# EAGLE design Tinyusbboard rev3 THT (EAGLE 6.5.0)
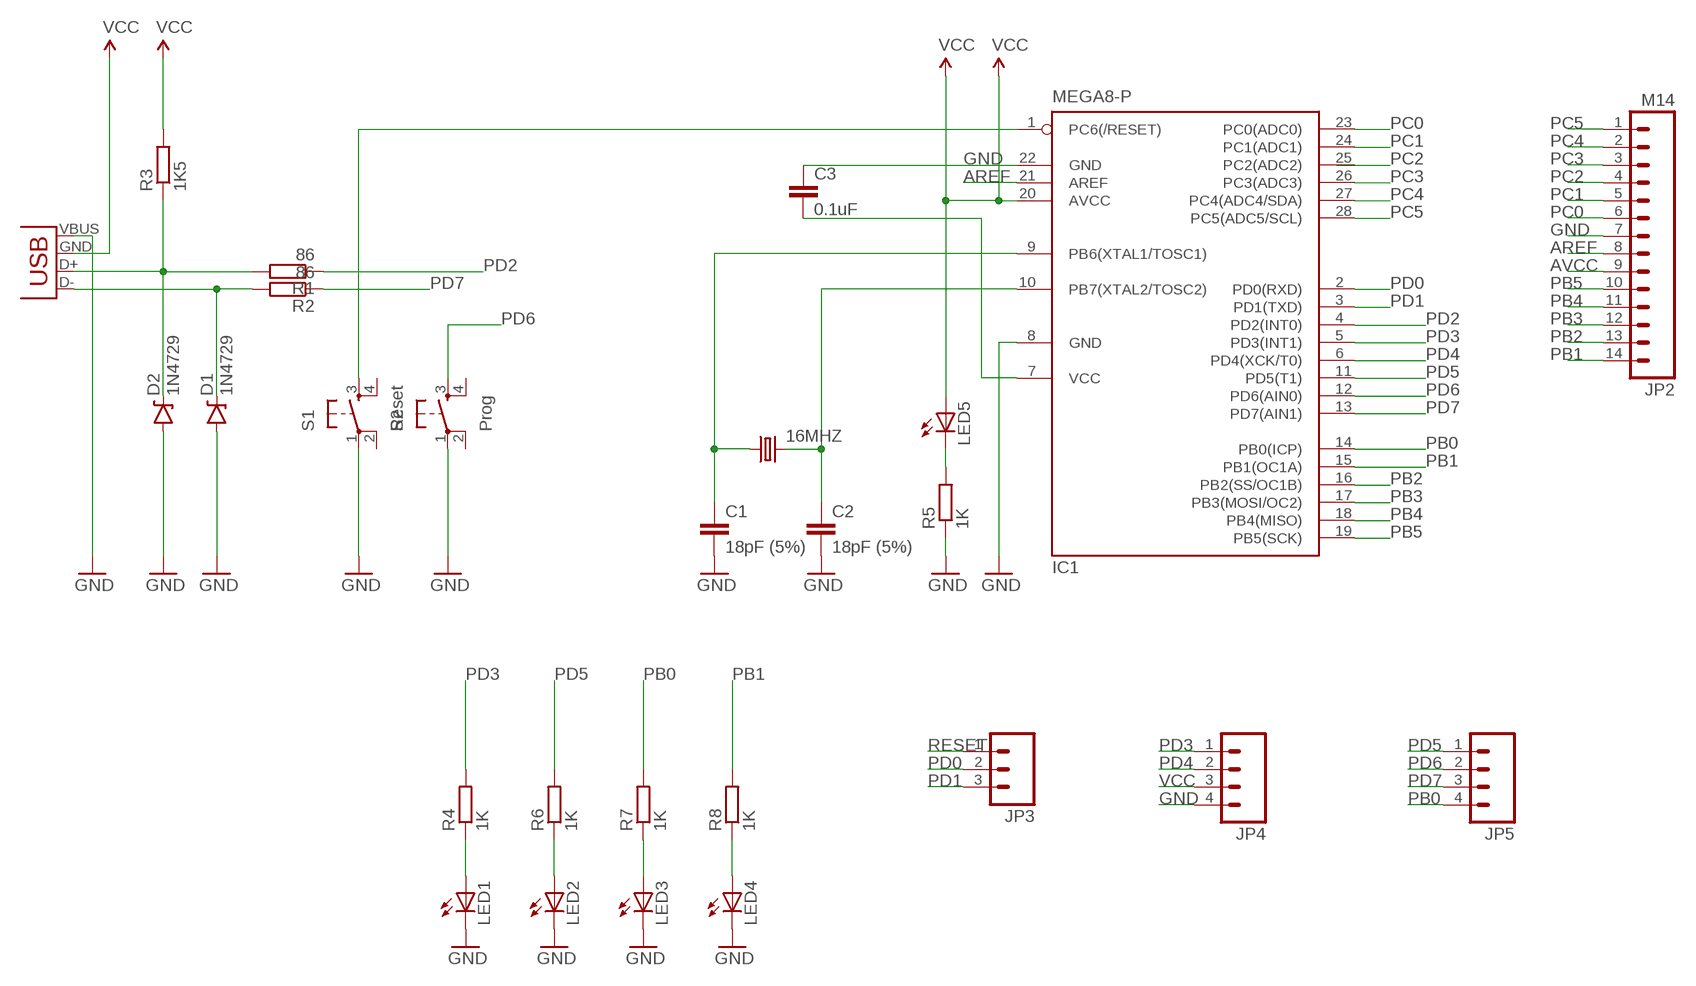
[diagram p0: schematic, sheet 1]

## Parts
16MHZ  CRYSTALTC26V  [TC26V]
C1  18pF (5%)  C-EU025-024X044  [C025-024X044]
C2  18pF (5%)  C-EU025-024X044  [C025-024X044]
C3  0.1uF  C-EU025-024X044  [C025-024X044]
D1  1N4729  DIODE-ZENERPTH  [DIODE-ZENER]
D2  1N4729  DIODE-ZENERPTH  [DIODE-ZENER]
IC1  MEGA8-P  [DIL28-3]
JP1  USB-A-H  [USB-A-H]
JP2  M14  [1X14]
JP3  M03PTH  [1X03]
JP4  M04PTH  [1X04]
JP5  M04PTH  [1X04]
LED1  LED3MM  [LED3MM]
LED2  LED3MM  [LED3MM]
LED3  LED3MM  [LED3MM]
LED4  LED3MM  [LED3MM]
LED5  LED3MM  [LED3MM]
R1  86  R-EU_0204/7  [0204/7]
R2  86  R-EU_0204/7  [0204/7]
R3  1K5  R-EU_0204/7  [0204/7]
R4  1K  R-EU_0204/7  [0204/7]
R5  1K  R-EU_0204/7  [0204/7]
R6  1K  R-EU_0204/2V  [0204V]
R7  1K  R-EU_0204/2V  [0204V]
R8  1K  R-EU_0204/7  [0204/7]
S1  Reset  TAC_SWITCHPTH  [TACTILE-PTH]
S2  Prog  TAC_SWITCHPTH  [TACTILE-PTH]

## Nets
AREF: IC1.21(AREF) JP2.8
AVCC: JP2.9
D+: D1.P$1(C) JP1.D-(D+) R2.2
D-: D2.P$1(C) JP1.D+(D-) R1.2 R3.1
GND: C1.2 C2.2 C3.1 D1.P$2(A) D2.P$2(A) IC1.8(GND) IC1.22(GND) JP1.VBUS(GND) JP2.7 JP4.4 LED1.K(C) LED2.K(C) LED3.K(C) LED4.K(C) R5.1 S1.1 S2.1
N$1: C3.2 IC1.7(VCC)
N$2: LED5.K(C) R5.2
N$6: LED1.A R4.1
N$7: LED2.A R6.1
N$8: LED3.A R7.1
N$12: LED4.A R8.1
N$15: 16MHZ.1 C1.1 IC1.9(PB6(XTAL1/TOSC1))
N$16: 16MHZ.2 C2.1 IC1.10(PB7(XTAL2/TOSC2))
PB0: IC1.14(PB0(ICP)) JP5.4 R7.2
PB1: IC1.15(PB1(OC1A)) JP2.14 R8.2
PB2: IC1.16(PB2(SS/OC1B)) JP2.13
PB3: IC1.17(PB3(MOSI/OC2)) JP2.12
PB4: IC1.18(PB4(MISO)) JP2.11
PB5: IC1.19(PB5(SCK)) JP2.10
PC0: IC1.23(PC0(ADC0)) JP2.6
PC1: IC1.24(PC1(ADC1)) JP2.5
PC2: IC1.25(PC2(ADC2)) JP2.4
PC3: IC1.26(PC3(ADC3)) JP2.3
PC4: IC1.27(PC4(ADC4/SDA)) JP2.2
PC5: IC1.28(PC5(ADC5/SCL)) JP2.1
PD0: IC1.2(PD0(RXD)) JP3.2
PD1: IC1.3(PD1(TXD)) JP3.3
PD2: IC1.4(PD2(INT0)) R1.1
PD3: IC1.5(PD3(INT1)) JP4.1 R4.2
PD4: IC1.6(PD4(XCK/T0)) JP4.2
PD5: IC1.11(PD5(T1)) JP5.1 R6.2
PD6: IC1.12(PD6(AIN0)) JP5.2 S2.3
PD7: IC1.13(PD7(AIN1)) JP5.3 R2.1
RESET: IC1.1(PC6(/RESET)) JP3.1 S1.3
VCC: IC1.20(AVCC) JP1.GND(VBUS) JP4.3 LED5.A R3.2
Unconnected: S1.2 S1.4 S2.2 S2.4

## Library data of the parts
16MHZ = adafruit:CRYSTAL: CRYSTAL; OC_FARNELL: unknown; OC_NEWARK: unknown
C1-C3 = rcl:C-EU: CAPACITOR, European symbol
D1 D2 = SparkFun-DiscreteSemi:DIODE-ZENER: Zener Diode Production Part - 8199 3.4V Zener Voltage
IC1 = atmel:MEGA8-P: MICROCONTROLLER 8 Kbytes FLASH, 1 kbytes SRAM, 512 bytes EEPROM, USART, 4-channel 10 bit ADC, 2-channel 8 bit ADC Pin compatible with Atmega48, ATMega88, ATMega168 Source: avr.lbr; OC_FARNELL: unknown; OC_NEWARK: unknown
JP1 = SparkFun-Connectors:USB: USB Connectors USB-B-PTH is fully proven SKU : PRT-00139/CONN-08278 USB-miniB is fully proven SKU : PRT-00587 USB-A-PCB is untested. USB-A-H is throughly reviewed, but untested. Spark Fun Electronics SKU : PRT-00437 USB-B-SMT is throughly reviewed, but untested. Needs silkscreen touching up. USB-A-S has not been used/tested USB-MB-H has not been used/tested USB-MICROB has been used. CONN-09505
JP2 = SparkFun-Connectors:M14: Header 14 Standard 14-pin 0.1" header. Use with straight break away headers (SKU : PRT-00116), right angle break away headers (PRT-00553), swiss pins (PRT-00743), machine pins (PRT-00117), and female headers (PRT-00115).
JP3 = SparkFun-Connectors:M03: Header 3 Standard 3-pin 0.1" header. Use with straight break away headers (SKU : PRT-00116), right angle break away headers (PRT-00553), swiss pins (PRT-00743), machine pins (PRT-00117), and female headers (PRT-00115). Molex polarized connector foot print use with SKU : PRT-08232 with associated crimp pins and housings.
JP4 JP5 = SparkFun-Connectors:M04: Header 4 Standard 4-pin 0.1" header. Use with straight break away headers (SKU : PRT-00116), right angle break away headers (PRT-00553), swiss pins (PRT-00743), machine pins (PRT-00117), and female headers (PRT-00115). Molex polarized connector foot print use with SKU : PRT-08231 with associated crimp pins and housings. 1MM SMD Version SKU: PRT-10208
LED1-LED5 = adafruit:LED: LED OSRAM: - CHIPLED LG R971, LG N971, LY N971, LG Q971, LY Q971, LO R971, LY R971 LH N974, LH R974 LS Q976, LO Q976, LY Q976 LO Q996 - Hyper CHIPLED LW Q18S LB Q993, LB Q99A, LB R99A - SideLED LS A670, LO A670, LY A670, LG A670, LP A670 LB A673, LV A673, LT A673, LW A673 LH A674 LY A675 LS A676, LA A676, LO A676, LY A676, LW A676 LS A679, LY A679, LG A679 - Hyper Micro SIDELED® LS Y876, LA Y876, LO Y876, LY Y876 LT Y87S - SmartLED LW L88C, LW L88S LB L89C, LB L89S, LG L890 LS L89K, LO L89K, LY L89K LS L896, LA L896, LO L896, LY L896 - TOPLED LS T670, LO T670, LY T670, LG T670, LP T670 LSG T670, LSP T670, LSY T670, LOP T670, LYG T670 LG T671, LOG T671, LSG T671 LB T673, LV T673, LT T673, LW T673 LH T674 LS T676, LA T676, LO T676, LY T676, LB T676, LH T676, LSB T676, LW T676 LB T67C, LV T67C, LT T67C, LS T67K, LO T67K, LY T67K, LW E67C LS E67B, LA E67B, LO E67B, LY E67B, LB E67C, LV E67C, LT E67C LW T67C LS T679, LY T679, LG T679 LS T770, LO T770, LY T770, LG T770, LP T770 LB T773, LV T773, LT T773, LW T773 LH T774 LS E675, LA E675, LY E675, LS T675 LS T776, LA T776, LO T776, LY T776, LB T776 LHGB T686 LT T68C, LB T68C - Hyper Mini TOPLED® LB M676 - Mini TOPLED Santana® LG M470 LS M47K, LO M47K, LY M47K Source: http://www.osram.convergy.de/
R1-R8 = rcl:R-EU_: RESISTOR, European symbol
S1 S2 = SparkFun-Retired:TAC_SWITCH: Momentary Switch Button commonly used for reset or general input. Spark Fun Electronics SKU : COM-00097 SMT- SWCH-08247

## Board
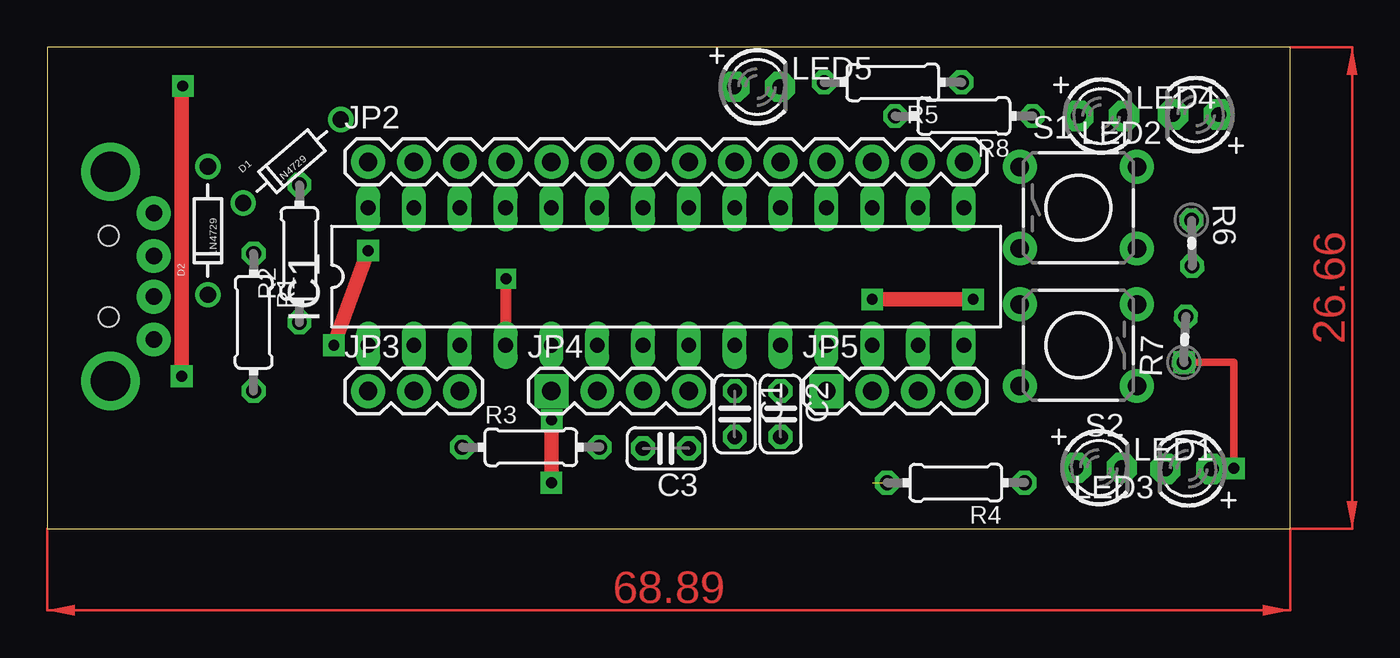
[diagram p1: board, top side]
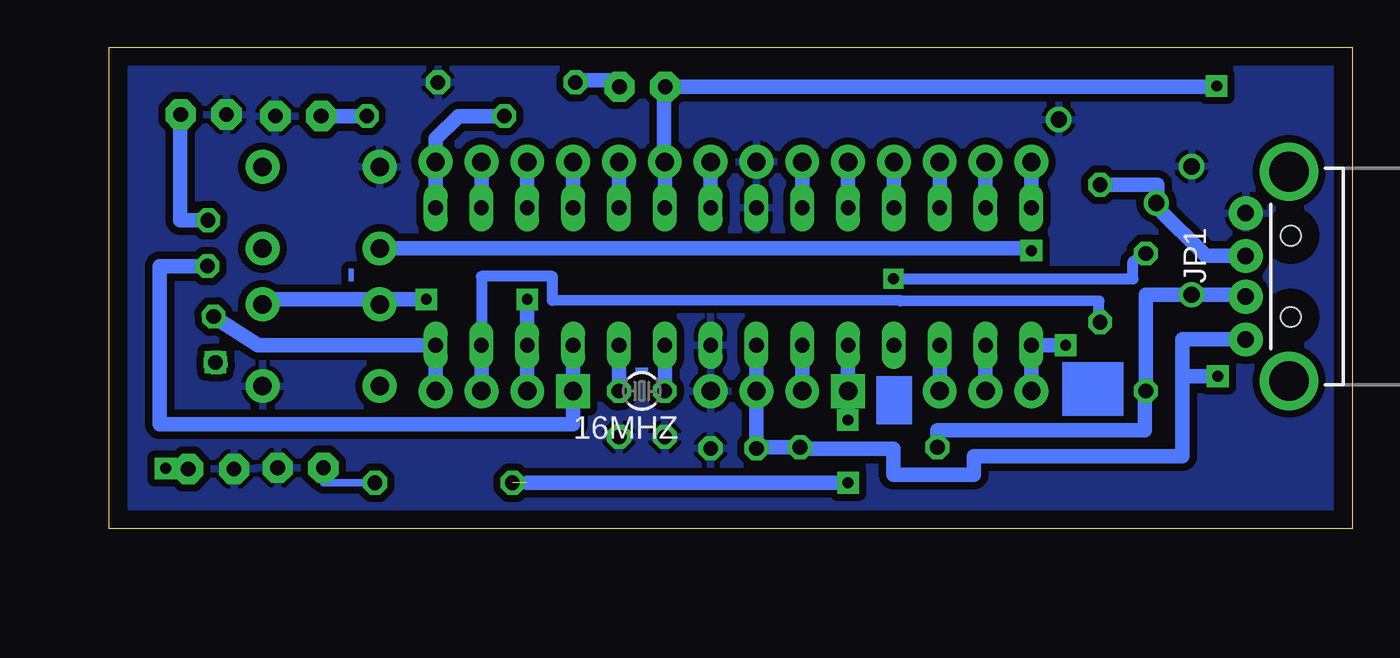
[diagram p2: board, bottom side, seen from below]

Size 68.89 x 26.66 mm. Coordinates in mm from the lower left corner, seen from the top.
Outline: 0,0 68.88,0 68.88,26.66 0,26.66 0,0
Copper layers (1*16): Top 0.035mm / dielectric 1.5mm / Bottom 0.035mm
Design rules "default *": minimum track width 10mil, minimum drill 24mil, track to track 12mil, track to pad 12mil, pad to pad 12mil, via to via 12mil, smd to smd 12mil, copper to edge 40mil, drill to drill 8mil, minimum pad ring 10mil, minimum via ring 8mil, stop-mask expansion 4mil, vias tented up to drill 0mil, thermal gap 10mil

### Footprints (pad centres in the part's own frame; a part is rotated, then mirrored left to right if it is on the bottom)
TC26V = drill 0.813: 1 -1.27,0; 2 1.27,0
C025-024X044 = drill 0.813 octagon: 1 -1.27,0; 2 1.27,0
DIODE-ZENER = drill 0.9: P$1 -3.556,0; P$2 3.556,0
DIL28-3 = drill 0.813 long: 1 -16.51,-3.81; 2 -13.97,-3.81; 3 -11.43,-3.81; 4 -8.89,-3.81; 5 -6.35,-3.81; 6 -3.81,-3.81; 7 -1.27,-3.81; 8 1.27,-3.81; 9 3.81,-3.81; 10 6.35,-3.81; 11 8.89,-3.81; 12 11.43,-3.81; 13 13.97,-3.81; 14 16.51,-3.81; 15 16.51,3.81; 16 13.97,3.81; 17 11.43,3.81; 18 8.89,3.81; 19 6.35,3.81; 20 3.81,3.81; 21 1.27,3.81; 22 -1.27,3.81; 23 -3.81,3.81; 24 -6.35,3.81; 25 -8.89,3.81; 26 -11.43,3.81; 27 -13.97,3.81; 28 -16.51,3.81
USB-A-H = drill 0.914 pad 1.88: D+ 2.4,1.127; D- 2.4,-1.127; GND 2.4,3.5; VBUS 2.4,-3.5 | drill 2.2: GND2 0,-5.8; GND3 0,5.8 | hole 1.1: -0.1,2.25; -0.1,-2.25
1X14 = drill 1.016 pad 1.88: 1 0,0; 2 2.54,0; 3 5.08,0; 4 7.62,0; 5 10.16,0; 6 12.7,0; 7 15.24,0; 8 17.78,0; 9 20.32,0; 10 22.86,0; 11 25.4,0; 12 27.94,0; 13 30.48,0; 14 33.02,0
1X03 = drill 1.016 pad 1.88: 1 0,0; 2 2.54,0; 3 5.08,0
1X04 = drill 1.016 pad 1.88 square: 1 0,0 | drill 1.016 pad 1.88: 2 2.54,0; 3 5.08,0; 4 7.62,0
LED3MM = drill 0.813 pad 1.676 octagon: A -1.27,0; K 1.27,0
0204/7 = drill 0.813 octagon: 1 -3.81,0; 2 3.81,0
0204V = drill 0.813 octagon: 1 -1.27,0; 2 1.27,0
TACTILE-PTH = drill 1.016 pad 1.88: 1 -3.251,2.261; 2 3.251,2.261; 3 -3.251,-2.261; 4 3.251,-2.261

### Placement (x,y rotation side)
16MHZ  39.37,7.62 180 bottom
C1  38.1,6.35 270 top
C2  40.64,6.35 270 top
C3  34.29,4.44 180 top
D1  13.55,20.35 40.5 top
D2  8.89,16.51 90 top
IC1  34.29,13.97 0 top
JP1  3.49,13.98 180 bottom
JP2  17.78,20.32 0 top
JP3  17.78,7.62 0 top
JP4  27.94,7.62 0 top
JP5  43.18,7.62 0 top
LED1  58.29,3.37 0 top
LED2  63.67,22.94 180 top
LED3  63.25,3.3 180 top
LED4  58.42,22.86 0 top
LED5  39.34,24.48 0 top
R1  11.43,11.43 270 top
R2  13.97,15.24 90 top
R3  26.8,4.51 0 top
R4  50.36,2.54 180 top
R5  46.86,24.72 180 top
R6  63.44,15.81 270.8 top
R7  63.06,10.48 87.6 top
R8  50.8,22.86 180 top
S1  57.15,17.78 0 top
S2  57.15,10.16 180 top

### Tracks (layer width: path | path; a pad name or v marks a point on that pad's centre or on a via)
AREF
  Bottom 0.813: JP2.8 IC1.21
D+
  Bottom 0.813: JP1.D- 8.12,15.1 10.79,17.78 | R2.2 10.79,19.05 10.79,17.78 | 10.79,17.78 10.85,17.78 D1.P$1
D-
  Bottom 0.406: R1.2 11.49,7.62
  Bottom 0.813: JP1.D+ 6,12.95 D2.P$1 11.43,12.95 R1.2 | 11.49,7.62 11.49,5.46 22.99,5.46 R3.1
GND
  pour Bottom (isolate 0.406): -0.57,28.89 73.41,28.89 73.41,-0.57 -0.57,-0.57
N$1
  Bottom 0.813: C3.2 33.01,7.65 33.02,7.65 IC1.7
N$2
  Bottom 0.406: LED5.K 40.63,24.48
  Bottom 0.813: 40.63,24.48 40.63,24.84 43.05,24.84 R5.2
N$6
  Bottom 0.406: R4.1 57.02,2.54 LED1.A
N$7
  Bottom 0.406: 63.5,17.08 R6.1 | LED2.A 64.96,22.94
  Bottom 0.813: 64.96,22.94 64.96,17.08 R6.1
N$8  (via drill 0.6 pad 1.2, 0.8 pad 1.2)
  Top 0.406: v63.01,9.22 65.76,9.2 v65.76,3.34
  Bottom 0.406: R7.1 63.06,9.21 v63.01,9.22 | LED3.A 65.76,3.3 v65.76,3.34
N$12
  Bottom 0.813: R8.1 LED4.A
N$15
  Bottom 0.813: IC1.9 16MHZ.1
N$16
  Bottom 0.813: IC1.10 16MHZ.2
PB0
  Bottom 0.813: JP5.4 IC1.14 60.65,10.16 R7.2
PB1
  Bottom 0.813: IC1.15 JP2.14 50.8,21.59 49.53,22.86 R8.2
PB2
  Bottom 0.813: JP2.13 IC1.16
PB3
  Bottom 0.813: JP2.12 IC1.17
PB4
  Bottom 0.813: JP2.11 IC1.18
PB5
  Bottom 0.813: JP2.10 IC1.19
PC0
  Bottom 0.813: JP2.6 IC1.23
PC1
  Bottom 0.813: JP2.5 IC1.24
PC2
  Bottom 0.813: JP2.4 IC1.25
PC3
  Bottom 0.813: JP2.3 IC1.26
PC4
  Bottom 0.813: JP2.2 IC1.27
PC5
  Bottom 0.813: JP2.1 IC1.28
PD0
  Bottom 0.813: JP3.2 IC1.2
PD1
  Bottom 0.813: JP3.3 IC1.3
PD2  (via drill 0.6, 0.6 pad 1.1)
  Top 0.61: v25.47,10.2 25.43,10.2 v25.43,13.84
  Bottom 0.61: IC1.4 25.47,10.16 v25.47,10.2 | v25.43,13.84 12.15,13.84 12.15,14.79 R1.1
PD3  (via drill 0.6 pad 1.2)  (1 unrouted)
  Top 0.813: v27.94,2.54 v27.95,6.02
  Bottom 0.813: v27.94,2.54 45.72,2.54 | v27.95,6.02 JP4.1 IC1.5
PD4
  Bottom 0.813: JP4.2 IC1.6
PD5
  Bottom 0.813: IC1.11 JP5.1 43.18,5.78 66.1,5.78 66.1,14.54 R6.2
PD6  (via drill 0.6 pad 1.2)
  Top 0.813: v51.32,12.7 v45.72,12.7
  Bottom 0.813: v45.72,12.7 IC1.12 JP5.2 | S2.3 60.4,12.7 v51.32,12.7
PD7
  Bottom 0.61: R2.1 14.04,11.43 14.04,12.6 25.05,12.61 25.05,12.64 44.33,12.65 44.33,13.98 48.26,13.98 IC1.13
  Bottom 0.813: IC1.13 JP5.3
RESET  (via drill 0.6 pad 1.2)
  Top 0.813: v17.78,15.4 v15.87,10.16
  Bottom 0.813: JP3.1 IC1.1 v15.87,10.16 | S1.3 17.78,15.52 v17.78,15.4
VCC  (via drill 0.6 pad 1.2)
  Top 0.813: v7.5,24.52 7.44,24.52 v7.44,8.44
  Bottom 0.813: 9.41,8.44 9.41,10.48 JP1.GND | 9.41,8.44 9.41,4.02 20.97,4.02 20.97,2.99 25.43,2.99 25.43,4.41 30.61,4.41 R3.2 33.02,4.51 JP4.3 | IC1.20 38.1,20.37 38.14,20.37 38.14,24.48 LED5.A 7.5,24.48 v7.5,24.52 | v7.44,8.44 9.41,8.44
(copper drawn outside any net)
  shapes: Bottom area x4, Top area x2